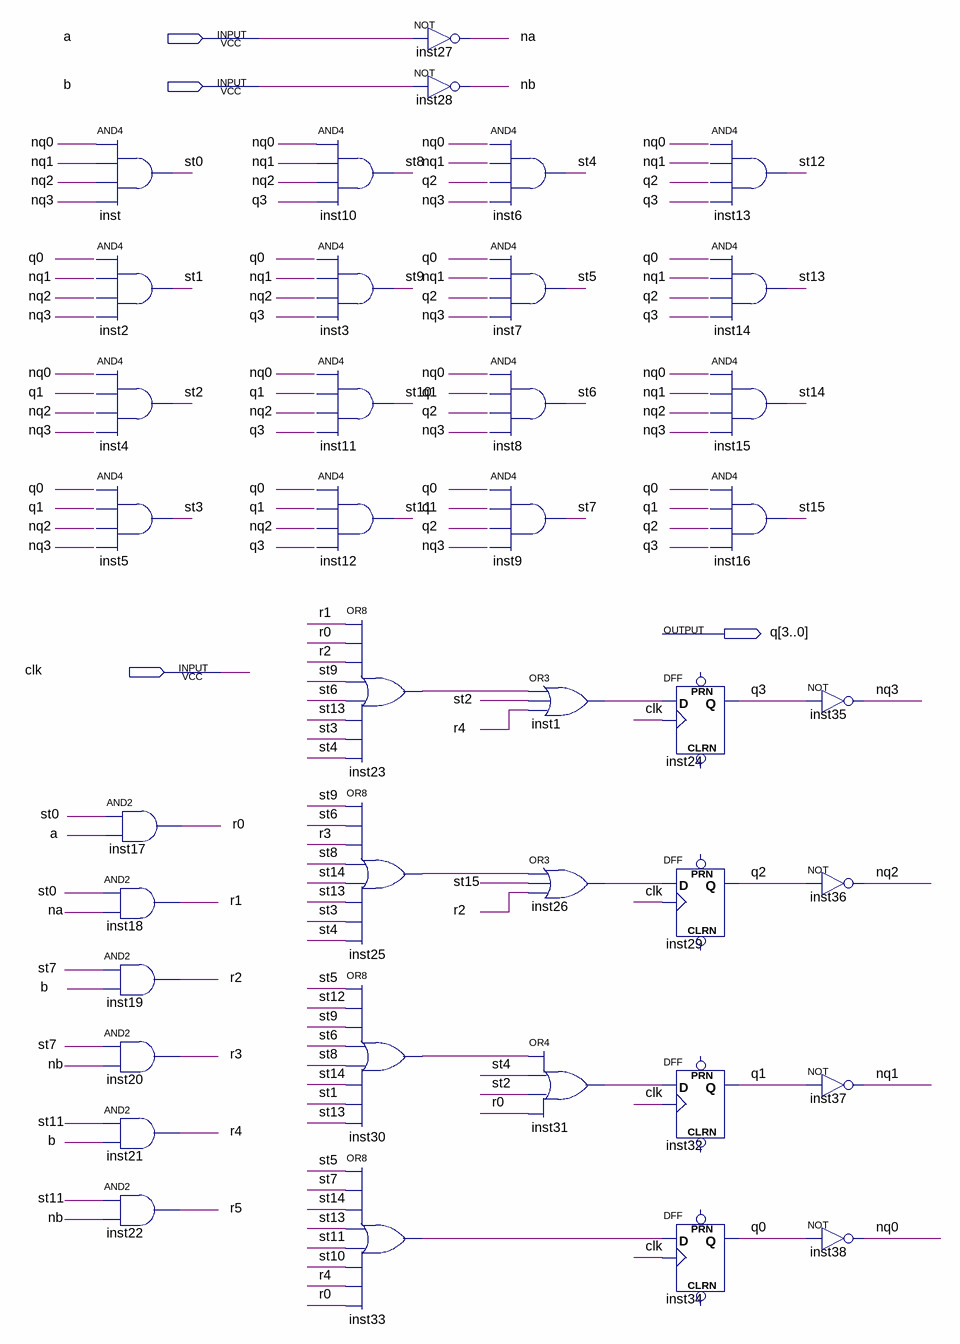
[diagram p0: schematic sheet]
// Quartus schematic lab_11.bdf as structural Verilog: 39 symbols, 4 pins
module lab_11 (
  input  a,
  input  b,
  input  clk,
  output [3:0] q
);

  wire inst1_out, inst23_out, inst25_out, inst26_out, inst30_out, inst31_out, inst33_out, na, nb, nq0, nq1,
       nq2, nq3, r0, r1, r2, r3, r4, r5, st0, st1, st2, st3, st4, st5, st6, st7, st8, st9, st10, st11, st12,
       st13, st14, st15;

  and inst (st0, nq0, nq1, nq2, nq3);
  // AND4 inst2 has open pins: IN1=open, IN2=open, IN3=open, IN4=open, OUT=st1
  // AND4 inst4 has open pins: IN1=open, IN2=open, IN3=open, IN4=open, OUT=st2
  // AND4 inst5 has open pins: IN1=open, IN2=open, IN3=open, IN4=open, OUT=st3
  and inst17 (r0, st0, a);
  and inst18 (r1, st0, na);
  and inst19 (r2, st7, b);
  and inst20 (r3, st7, nb);
  and inst21 (r4, st11, b);
  and inst22 (r5, st11, nb);
  and inst10 (st8, nq0, nq1, nq2, q[3]);
  // AND4 inst3 has open pins: IN1=open, IN2=open, IN3=open, IN4=open, OUT=st9
  // AND4 inst11 has open pins: IN1=open, IN2=open, IN3=open, IN4=open, OUT=st10
  // AND4 inst12 has open pins: IN1=open, IN2=open, IN3=open, IN4=open, OUT=st11
  or inst23 (inst23_out, r1, r0, r2, st9, st6, st13, st3, st4);
  or inst25 (inst25_out, st9, st6, r3, st8, st14, st13, st3, st4);
  or inst30 (inst30_out, st5, st12, st9, st6, st8, st14, st1, st13);
  or inst33 (inst33_out, st5, st7, st14, st13, st11, st10, r4, r0);
  not inst27 (na, a);
  not inst28 (nb, b);
  // AND4 inst6 has open pins: IN1=open, IN2=open, IN3=open, IN4=open, OUT=st4
  // AND4 inst7 has open pins: IN1=open, IN2=open, IN3=open, IN4=open, OUT=st5
  // AND4 inst8 has open pins: IN1=open, IN2=open, IN3=open, IN4=open, OUT=st6
  // AND4 inst9 has open pins: IN1=open, IN2=open, IN3=open, IN4=open, OUT=st7
  or inst1 (inst1_out, inst23_out, st2, r4);
  or inst26 (inst26_out, inst25_out, st15, r2);
  or inst31 (inst31_out, inst30_out, st4, st2, r0);
  // AND4 inst13 has open pins: IN1=open, IN2=open, IN3=open, IN4=open, OUT=st12
  // AND4 inst14 has open pins: IN1=open, IN2=open, IN3=open, IN4=open, OUT=st13
  // AND4 inst15 has open pins: IN1=open, IN2=open, IN3=open, IN4=open, OUT=st14
  // AND4 inst16 has open pins: IN1=open, IN2=open, IN3=open, IN4=open, OUT=st15
  DFF inst24 (.CLK(clk), .D(inst1_out), .Q(q[3]));  // open: CLRN, PRN
  DFF inst29 (.CLK(clk), .D(inst26_out), .Q(q[2]));  // open: CLRN, PRN
  DFF inst32 (.CLK(clk), .D(inst31_out), .Q(q[1]));  // open: CLRN, PRN
  DFF inst34 (.CLK(clk), .D(inst33_out), .Q(q[0]));  // open: CLRN, PRN
  not inst35 (nq3, q[3]);
  not inst36 (nq2, q[2]);
  not inst37 (nq1, q[1]);
  not inst38 (nq0, q[0]);
endmodule
